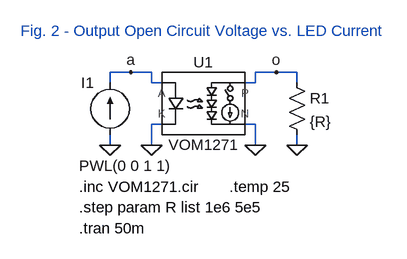
[diagram p0: schematic VOM1271_DC.asc]
VOM1271_DC.asc, the LTspice schematic file:
Version 4
SHEET 1 932 680
WIRE -160 80 -192 80
WIRE -128 80 -160 80
WIRE 64 80 32 80
WIRE 96 80 64 80
WIRE -192 96 -192 80
WIRE -128 96 -128 80
WIRE -112 96 -128 96
WIRE 32 96 32 80
WIRE 32 96 16 96
WIRE 96 96 96 80
WIRE -112 160 -128 160
WIRE 32 160 16 160
WIRE -192 192 -192 176
WIRE -128 192 -128 160
WIRE 32 192 32 160
WIRE 96 192 96 176
FLAG -160 80 a
FLAG -192 192 0
FLAG 96 192 0
FLAG 64 80 o
FLAG -128 192 0
FLAG 32 192 0
SYMBOL current -192 176 R180
WINDOW 0 24 80 Left 2
WINDOW 3 48 -48 Right 2
WINDOW 123 0 0 Left 2
WINDOW 39 0 0 Left 2
SYMATTR InstName I1
SYMATTR Value PWL(0 0 1 1)
SYMBOL res 80 80 R0
SYMATTR InstName R1
SYMATTR Value {R}
SYMBOL VOM1271 -48 128 R0
SYMATTR InstName U1
TEXT -240 320 Left 2 !.tran 50m
TEXT -240 256 Left 2 !.inc VOM1271.cir
TEXT -240 288 Left 2 !.step param R list 1e6 5e5
TEXT -8 256 Left 2 !.temp 25
TEXT -48 32 Bottom 2 ;Fig. 2 - Output Open Circuit Voltage vs. LED Current

The netlist it stands for:
* VOM1271_DC.asc
I1 0 a PWL(0 0 1 1)
R1 o 0 {R}
XU1 a 0 o 0 VOM1271 VOM1271  ; pins A K P N
.tran 50m
.inc VOM1271.cir
.step param R list 1e6 5e5
.temp 25
* Fig. 2 - Output Open Circuit Voltage vs. LED Current
.lib VOM1271.cir
.backanno
.end